# Altium project OpAmp_PSU_01.PrjPcb
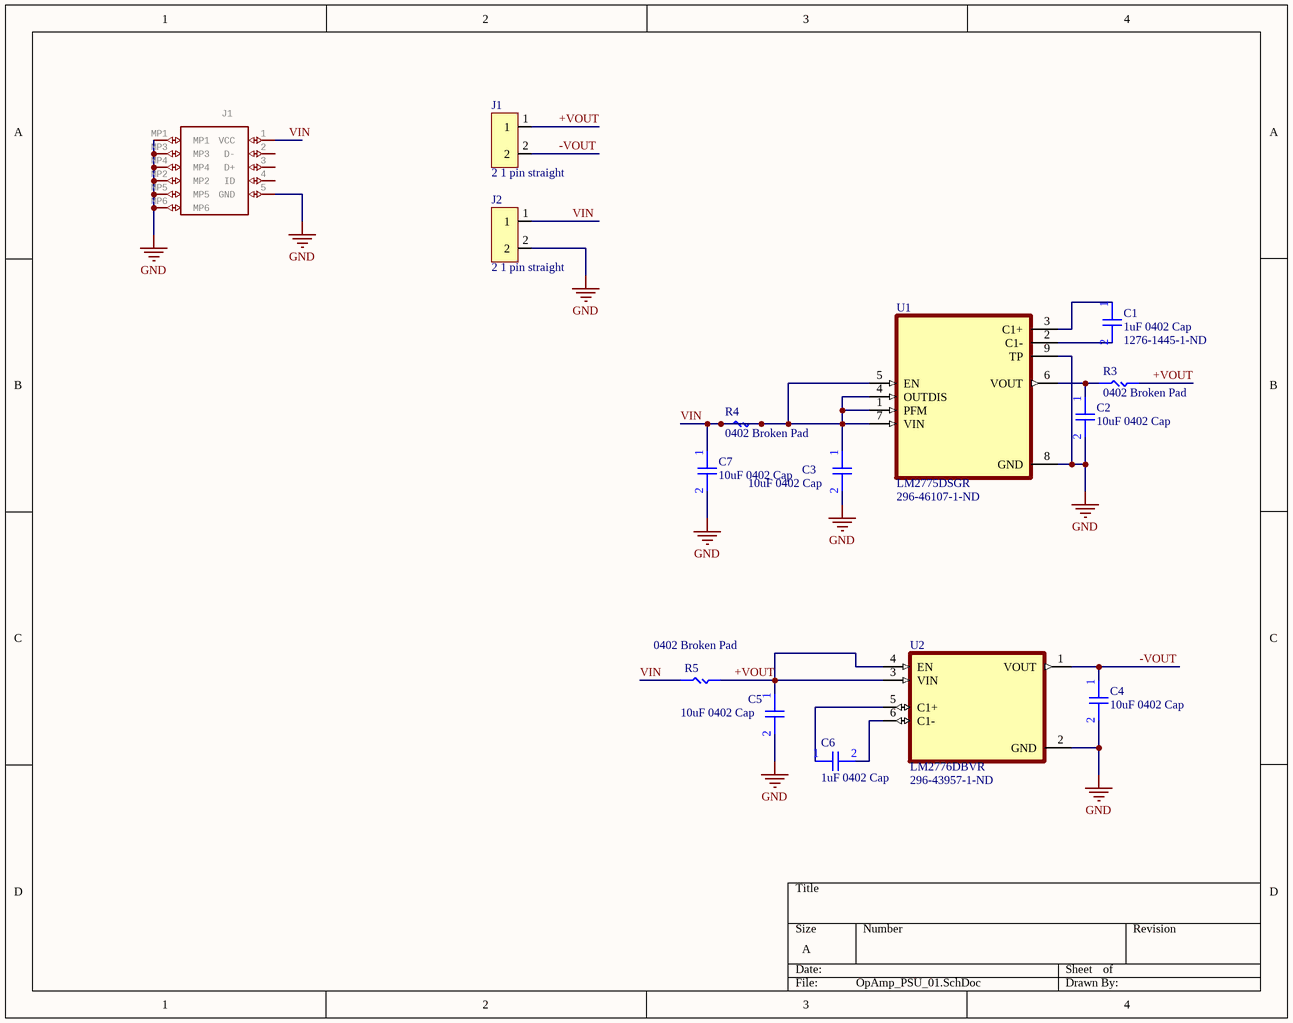
[diagram p0: OpAmp_PSU_01.SchDoc]
1 sheet, 15 parts. Net scope: global (net labels, ports and power ports of the same name join across sheets).
Board file: OpAmp_PSU_01.PcbDoc

## Sheet OpAmp_PSU_01.SchDoc
size A; SheetNumber: 1; SheetTotal: 1

### Parts
(Parts that share a designator on the sheet are numbered #1, #2 ... from top to bottom, then left to right.)
C1  1uF 0402 Cap  Supplier Part Number 1: 1276-1445-1-ND  [0402 Cap]
C2  10uF 0402 Cap  [0402 Cap]
C3  10uF 0402 Cap  [0402 Cap]
C4  10uF 0402 Cap  [0402 Cap]
C5  10uF 0402 Cap  [0402 Cap]
C6  1uF 0402 Cap  [0402 Cap]
C7  10uF 0402 Cap  [0402 Cap]
J1#1  USB Connectors SMD RoHS   Source:  Datasheet  [C40942]  (value not drawn)
J1#2  2 1 pin straight  [2 1 pin staright]
J2  2 1 pin straight  [2 1 pin staright]
R3  0402 Broken Pad  [0402 broken pad]
R4  0402 Broken Pad  [0402 broken pad]
R5  0402 Broken Pad  [0402 broken pad]
U1  LM2775DSGR  Supplier Part Number 1: 296-46107-1-ND  [SON50P200X200X80-9N]
U2  LM2776DBVR  Supplier Part Number 1: 296-43957-1-ND  [SOT95P280X145-6N]

### Nets
GND: C2.2 C3.2 C4.2 C5.2 C7.2 J1#1.5(GND) J1#1.MP1 J1#1.MP2 J1#1.MP3 J1#1.MP4 J1#1.MP5 J1#1.MP6 J2.2 U1.8(GND) U1.9(TP) U2.2(GND)
+VOUT: C5.1 J1#2.1 R3.2 R5.2 U2.3(VIN) U2.4(EN)
-VOUT: C4.1 J1#2.2 U2.1(VOUT)
VIN: C3.1 C7.1 J1#1.1(VCC) J2.1 R4.1 R4.2 R5.1 U1.1(PFM) U1.4(OUTDIS) U1.5(EN) U1.7(VIN)
NetC1_1: C1.1 U1.3(C1+)
NetC1_2: C1.2 U1.2(C1-)
NetC2_1: C2.1 R3.1 U1.6(VOUT)
NetC6_1: C6.1 U2.5(C1+)
NetC6_2: C6.2 U2.6(C1-)

Not connected (* = marked no-connect by the designer): J1#1 2(D-) 3(D+) 4(ID)

### Library data of the parts
C1 C6 = 1uF 0402 Cap: C52923; ComponentLink1Description: New link; ComponentLink1URL: *; Supplier 1: Digi-Key
  C6: Supplier Part Number 1: 1276-1445-1-ND
C2-C5 C7 = 10uF 0402 Cap: C15525; ComponentLink1Description: New link; ComponentLink1URL: *; Supplier 1: Digi-Key; Supplier Part Number 1: 1276-1451-1-ND
J1#1 = C40942: Manufacturer_Name: Jing Extension of the Electronic Co.; GateName_1: G$1; SymbolName_1: C40942; LibraryName: C40942; DeviceSetName: C40942; Package: C40942; Manufacturer_Part_Number: C40942; Height: 2.55mm
U1 = LM2775DSGR: C473361; MF: {'manufacturer': u'Texas Instruments'}; Availability: Unavailable; Price: None; MP: LM2775DSGR; Package: None; Value: *; Supplier 1: Digi-Key
U2 = LM2776DBVR: C69527; MF: {'manufacturer': u'Texas Instruments'}; Value: *; Package: None; Price: None; MP: LM2776DBVR; Availability: Unavailable; Supplier 1: Digi-Key